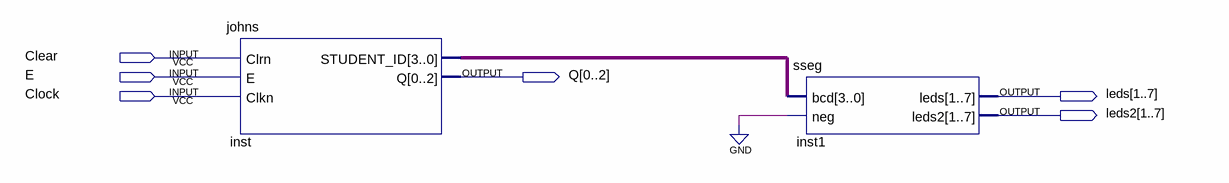
[diagram p0: schematic sheet]
// Quartus schematic JohnsonCounter.bdf as structural Verilog: 2 symbols, 6 pins
module JohnsonCounter (
  input  Clear,
  input  E,
  input  Clock,
  output [0:2] Q,
  output [1:7] leds,
  output [1:7] leds2
);

  wire [3:0] inst_student_id;

  johns inst (.Clrn(Clear), .E(E), .Clkn(Clock), .STUDENT_ID(inst_student_id), .Q(Q));
  sseg inst1 (.bcd(inst_student_id), .neg(1'b0), .leds(leds), .leds2(leds2));
endmodule
